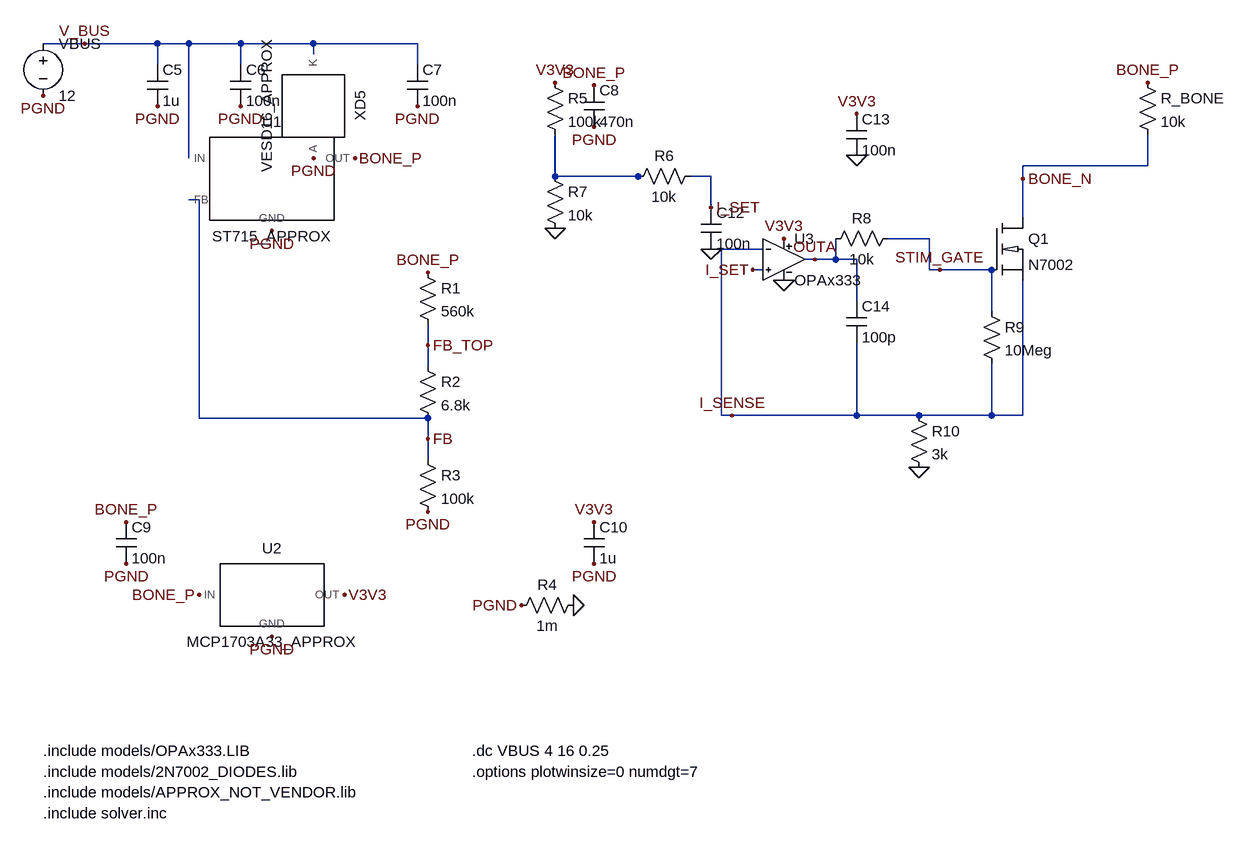
[diagram p0: schematic full_bus.asc]
full_bus.asc, the LTspice schematic file:
Version 4.1
SHEET 1 2200 1500
SYMBOL res 1012 356 R0
SYMATTR InstName R5
SYMATTR Value 100k
SYMBOL res 1012 500 R0
SYMATTR InstName R7
SYMATTR Value 10k
WIRE 1028 452 1028 516
SYMBOL res 1252 500 R90
WINDOW 0 0 56 VBottom 2
WINDOW 3 32 56 VTop 2
SYMATTR InstName R6
SYMATTR Value 10k
WIRE 1028 516 1156 516
WIRE 1156 516 1156 516
SYMBOL cap 1252 564 R0
SYMATTR InstName C12
SYMATTR Value 100n
WIRE 1236 516 1268 516
WIRE 1268 516 1268 564
FLAG 1268 564 I_SET
FLAG 1268 628 0
FLAG 1028 596 0
FLAG 1028 372 V3V3
SYMBOL OPAx333 1380 580 R0
SYMATTR InstName U3
SYMATTR Value OPAx333
WIRE 1348 660 1332 660
FLAG 1332 660 I_SET
FLAG 1380 612 V3V3
FLAG 1380 676 0
SYMBOL cap 1476 420 R0
SYMATTR InstName C13
SYMATTR Value 100n
FLAG 1492 420 V3V3
FLAG 1492 484 0
WIRE 1412 644 1460 644
WIRE 1460 644 1492 644
FLAG 1428 644 OUTA
SYMBOL res 1556 596 R90
WINDOW 0 0 56 VBottom 2
WINDOW 3 32 56 VTop 2
SYMATTR InstName R8
SYMATTR Value 10k
WIRE 1460 612 1460 644
SYMBOL cap 1476 708 R0
SYMATTR InstName C14
SYMATTR Value 100p
WIRE 1492 644 1492 708
WIRE 1492 772 1492 884
SYMBOL N7002 1700 580 R0
SYMATTR InstName Q1
SYMATTR Value N7002
WIRE 1540 612 1604 612
WIRE 1604 612 1604 660
WIRE 1604 660 1700 660
FLAG 1620 660 STIM_GATE
FLAG 1748 520 BONE_N
SYMBOL res 1684 708 R0
SYMATTR InstName R9
SYMATTR Value 10Meg
WIRE 1700 660 1700 724
WIRE 1700 804 1700 884
WIRE 1748 676 1748 884
SYMBOL res 1572 868 R0
SYMATTR InstName R10
SYMATTR Value 3k
FLAG 1588 964 0
WIRE 1348 628 1284 628
WIRE 1284 628 1284 884
WIRE 1284 884 1492 884
WIRE 1492 884 1588 884
WIRE 1588 884 1700 884
WIRE 1700 884 1748 884
FLAG 1300 884 I_SENSE
SYMBOL res 1924 356 R0
SYMATTR InstName R_BONE
SYMATTR Value 10k
FLAG 1940 372 BONE_P
WIRE 1940 452 1940 500
WIRE 1940 500 1748 500
WIRE 1748 500 1748 580
SYMBOL voltage 240 296 R0
SYMATTR InstName VBUS
SYMATTR Value 12
FLAG 240 392 PGND
SYMBOL cap 400 344 R0
SYMATTR InstName C5
SYMATTR Value 1u
SYMBOL cap 528 344 R0
SYMATTR InstName C6
SYMATTR Value 100n
SYMBOL cap 800 344 R0
SYMATTR InstName C7
SYMATTR Value 100n
SYMBOL VESD16_APPROX 656 408 R90
SYMATTR InstName XD5
SYMATTR Value VESD16_APPROX
WIRE 416 312 416 344
FLAG 416 408 PGND
WIRE 544 312 544 344
FLAG 544 408 PGND
WIRE 816 312 816 344
FLAG 816 408 PGND
WIRE 656 312 656 328
FLAG 656 488 PGND
WIRE 240 312 416 312
WIRE 416 312 464 312
WIRE 464 312 544 312
WIRE 544 312 656 312
WIRE 656 312 816 312
FLAG 304 312 V_BUS
SYMBOL ST715_APPROX 592 520 R0
SYMATTR InstName U1
SYMATTR Value ST715_APPROX
WIRE 464 312 464 488
FLAG 720 488 BONE_P
FLAG 592 600 PGND
SYMBOL cap 1072 376 R0
SYMATTR InstName C8
SYMATTR Value 470n
FLAG 1088 376 BONE_P
FLAG 1088 440 PGND
SYMBOL res 816 648 R0
SYMATTR InstName R1
SYMATTR Value 560k
SYMBOL res 816 792 R0
SYMATTR InstName R2
SYMATTR Value 6.8k
SYMBOL res 816 936 R0
SYMATTR InstName R3
SYMATTR Value 100k
FLAG 832 664 BONE_P
WIRE 832 744 832 808
FLAG 832 776 FB_TOP
WIRE 832 888 832 952
FLAG 832 920 FB
FLAG 832 1032 PGND
WIRE 832 888 480 888
WIRE 480 888 480 552
WIRE 480 552 464 552
SYMBOL MCP1703A33_APPROX 592 1160 R0
SYMATTR InstName U2
SYMATTR Value MCP1703A33_APPROX
FLAG 480 1160 BONE_P
FLAG 704 1160 V3V3
FLAG 592 1224 PGND
SYMBOL cap 352 1048 R0
SYMATTR InstName C9
SYMATTR Value 100n
FLAG 368 1048 BONE_P
FLAG 368 1112 PGND
SYMBOL cap 1072 1048 R0
SYMATTR InstName C10
SYMATTR Value 1u
FLAG 1088 1048 V3V3
FLAG 1088 1112 PGND
SYMBOL res 1072 1160 R90
WINDOW 0 0 56 VBottom 2
WINDOW 3 32 56 VTop 2
SYMATTR InstName R4
SYMATTR Value 1m
FLAG 1056 1176 0
FLAG 976 1176 PGND
TEXT 240 1400 Left 2 !.include models/OPAx333.LIB
TEXT 240 1432 Left 2 !.include models/2N7002_DIODES.lib
TEXT 240 1464 Left 2 !.include models/APPROX_NOT_VENDOR.lib
TEXT 240 1496 Left 2 !.include solver.inc
TEXT 900 1400 Left 2 !.dc VBUS 4 16 0.25
TEXT 900 1432 Left 2 !.options plotwinsize=0 numdgt=7

The netlist it stands for:
* full_bus.asc
R5 V3V3 N001 100k
R7 N001 0 10k
R6 I_SET N001 10k
C12 I_SET 0 100n
X§U3 OPAx333
C13 V3V3 0 100n
R8 STIM_GATE OUTA 10k
C14 OUTA I_SENSE 100p
X§Q1 BONE_N STIM_GATE I_SENSE N7002  ; pins D G S
R9 STIM_GATE I_SENSE 10Meg
R10 I_SENSE 0 3k
R_BONE BONE_P BONE_N 10k
VBUS V_BUS PGND 12
C5 V_BUS PGND 1u
C6 V_BUS PGND 100n
C7 V_BUS PGND 100n
X§XD5 V_BUS PGND VESD16_APPROX  ; pins K A
X§U1 V_BUS BONE_P PGND FB ST715_APPROX  ; pins IN OUT GND FB
C8 BONE_P PGND 470n
R1 BONE_P FB_TOP 560k
R2 FB_TOP FB 6.8k
R3 FB PGND 100k
X§U2 BONE_P V3V3 PGND MCP1703A33_APPROX  ; pins IN OUT GND
C9 BONE_P PGND 100n
C10 V3V3 PGND 1u
R4 0 PGND 1m
.include models/OPAx333.LIB
.include models/2N7002_DIODES.lib
.include models/APPROX_NOT_VENDOR.lib
.include solver.inc
.dc VBUS 4 16 0.25
.options plotwinsize=0 numdgt=7
.backanno
.end